# EAGLE design NanoV3.3 (EAGLE 9.6.2)
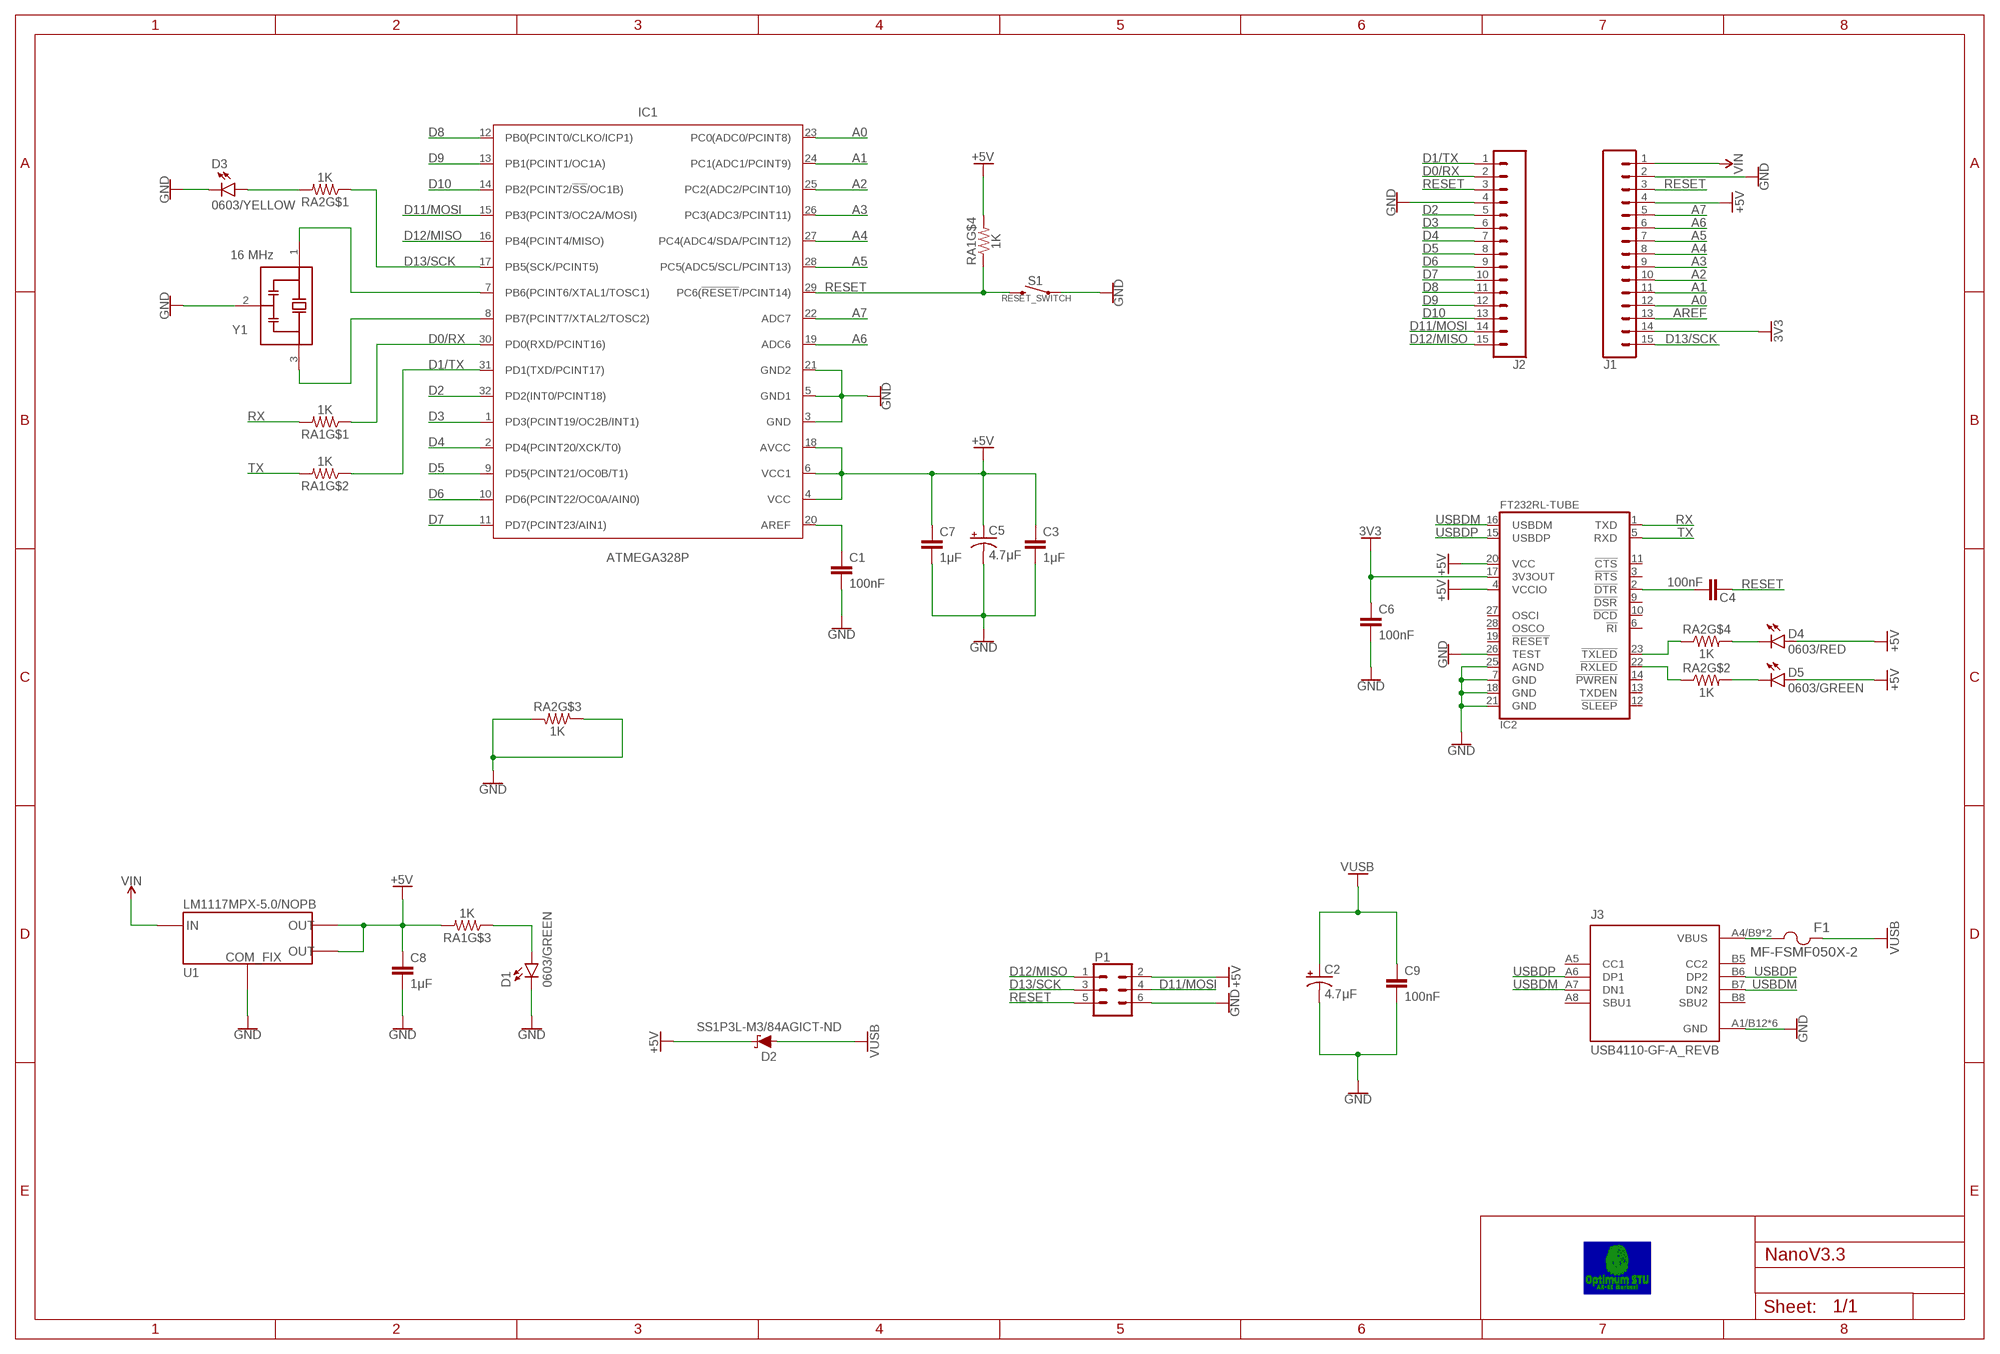
[diagram p0: schematic, sheet 1]

## Parts
C1  100nF  100NF_0603(1608METRIC)_±10%_16V_CERAMIC_CAPACITOR_X7R  [CAP_0603(1608_METRIC)]
C2  4.7μF  4.7UF_TANTALUM_CAPACITOR_MOLDED_1206(3216_METRIC)_TYPE_A_16V_4OHM  [CAP_TANT_1206(3216_METRIC)_TYPE_A_MAX]
C3  1μF  1UF_0603(1608METRIC)_±10%_16V_CERAMIC_CAPACITOR_X7R  [CAP_0603(1608_METRIC)]
C4  100nF  100NF_0603(1608METRIC)_±10%_16V_CERAMIC_CAPACITOR_X7R  [CAP_0603(1608_METRIC)]
C5  4.7μF  4.7UF_TANTALUM_CAPACITOR_MOLDED_1206(3216_METRIC)_TYPE_A_16V_4OHM  [CAP_TANT_1206(3216_METRIC)_TYPE_A_MAX]
C6  100nF  100NF_0603(1608METRIC)_±10%_16V_CERAMIC_CAPACITOR_X7R  [CAP_0603(1608_METRIC)]
C7  1μF  1UF_0603(1608METRIC)_±10%_16V_CERAMIC_CAPACITOR_X7R  [CAP_0603(1608_METRIC)]
C8  1μF  1UF_0603(1608METRIC)_±10%_16V_CERAMIC_CAPACITOR_X7R  [CAP_0603(1608_METRIC)]
C9  100nF  100NF_0603(1608METRIC)_±10%_16V_CERAMIC_CAPACITOR_X7R  [CAP_0603(1608_METRIC)]
D1  0603/GREEN  LED_GREEN_571NM_0603(1608_METRIC)_INDICATION-DISCRETE_2V  [LED_0603(1608_METRIC)_GREEN]
D2  SS1P3L-M3/84AGICT-ND  SS1P3L-M3/84ADIODE_SS1P3L-M3/84A_VIS-M  [DO-220AA(SMP)-M]
D3  0603/YELLOW  LED_YELLOW_591NM_0603(1608_METRIC)_INDICATION-DISCRETE_2.1V  [LED_0603(1608_METRIC)_YELLOW]
D4  0603/RED  LED_RED_631NM_0603(1608_METRIC)_INDICATION-DISCRETE_2V  [LED_0603(1608_METRIC)_RED]
D5  0603/GREEN  LED_GREEN_571NM_0603(1608_METRIC)_INDICATION-DISCRETE_2V  [LED_0603(1608_METRIC)_GREEN]
F1  MF-FSMF050X-2  [PTC_FUSE_0603(1608_METRIC)]
IC1  ATMEGA328P  ATMEGA328P_TQFP  [32-TQFP]
IC2  FT232RL-TUBE  [28-SSOP]
J1  CONN_15_M_180C  [HDRV15W64P254_1X15_3810X254X838B]
J2  CONN_15_M_180C  [HDRV15W64P254_1X15_3810X254X838B]
J3  USB4110-GF-A_REVB  [GCT_USB4110-GF-A_REVB]
P1  CONN_2X3_M_180C  [HDRV6W64P254_2X3_762X508X838B]
RA1  1K  1KOHM_ARRAY_4_ELEMENT_ISOLATED_NETWORK/ARRAY_±5%_62.5MW_FOR_PER_RESISTOR_±200PPM/°C_1206(3216_METRIC),CONVEX,LONG_SIDE_TERMINALS  [RESISTOR_ARRAY_1206(3216_METRIC)_WIDE]
RA2  1K  1KOHM_ARRAY_4_ELEMENT_ISOLATED_NETWORK/ARRAY_±5%_62.5MW_FOR_PER_RESISTOR_±200PPM/°C_1206(3216_METRIC),CONVEX,LONG_SIDE_TERMINALS  [RESISTOR_ARRAY_1206(3216_METRIC)_WIDE]
S1  RESET SWITCH  RS-282C05A3-SM_RT  [SW_TS09-63-25-WT-260-SMT-TR]
U1  LM1117MPX-5.0/NOPB  LM1117MPX-5.0/NOPB_LINEAR_VOLTAGE_REGULATOR_IC_POSITIVE_FIXED_1OUTPUT_800MA_SOT-223-4  [SOT-223-4]
Y1  16 MHz  CSTNE16M0V53L000R0_16MHZ_CERAMIC_RESONATOR_BUILT-IN_CAPACITOR_15PF_±0.2%_40OHMS-40°C~85°C_SURFACE_MOUNT  [RESONATOR_SMD-3(3.20MMX1.30MM)]

## Nets
3V3: C6.1 IC2.17(3V3OUT) J1.14
+5V: C3.1 C5.1(+) C7.1 C8.1 D2.1(C) D4.A D5.A IC1.4(VCC) IC1.6(VCC1) IC1.18(AVCC) IC2.4(VCCIO) IC2.20(VCC) J1.4 P1.2 RA1.5 RA1.6 U1.2(OUTPUT_JUNCTİON) U1.4(OUTPUT_TAB)
A0: IC1.23(PC0(ADC0/PCINT8)) J1.12
A1: IC1.24(PC1(ADC1/PCINT9)) J1.11
A2: IC1.25(PC2(ADC2/PCINT10)) J1.10
A3: IC1.26(PC3(ADC3/PCINT11)) J1.9
A4: IC1.27(PC4(ADC4/SDA/PCINT12)) J1.8
A5: IC1.28(PC5(ADC5/SCL/PCINT13)) J1.7
A6: IC1.19(ADC6) J1.6
A7: IC1.22(ADC7) J1.5
AREF: C1.1 IC1.20(AREF) J1.13
D0/RX: IC1.30(PD0(RXD/PCINT16)) J2.2 RA1.1
D1/TX: IC1.31(PD1(TXD/PCINT17)) J2.1 RA1.2
D2: IC1.32(PD2(INT0/PCINT18)) J2.5
D3: IC1.1(PD3(PCINT19/OC2B/INT1)) J2.6
D4: IC1.2(PD4(PCINT20/XCK/T0)) J2.7
D5: IC1.9(PD5(PCINT21/OC0B/T1)) J2.8
D6: IC1.10(PD6(PCINT22/OC0A/AIN0)) J2.9
D7: IC1.11(PD7(PCINT23/AIN1)) J2.10
D8: IC1.12(PB0(PCINT0/CLKO/ICP1)) J2.11
D9: IC1.13(PB1(PCINT1/OC1A)) J2.12
D10: IC1.14(PB2(PCINT2/!SS!/OC1B)) J2.13
D11/MOSI: IC1.15(PB3(PCINT3/OC2A/MOSI)) J2.14 P1.4
D12/MISO: IC1.16(PB4(PCINT4/MISO)) J2.15 P1.1
D13/SCK: IC1.17(PB5(SCK/PCINT5)) J1.15 P1.3 RA2.1
DTR: C4.2 IC2.2(!DTR)
GND: C1.2 C2.2(-) C3.2 C5.2(-) C6.2 C7.2 C8.2 C9.2 D1.C D3.C IC1.3(GND) IC1.5(GND1) IC1.21(GND2) IC2.7(GND) IC2.18(GND) IC2.21(GND) IC2.25(AGND) IC2.26(TEST) J1.2 J2.4 J3.A1/B12(GND) J3.B1/A12(GND) J3.S1(GND) J3.S2(GND) J3.S3(GND) J3.S4(GND) P1.6 RA2.3 RA2.6 S1.1 U1.1(COMMON_FIXED) Y1.2(GND)
N$1: D3.A RA2.8
N$10: D1.A RA1.3
N$12: F1.1 J3.A4/B9(VBUS) J3.B4/A9(VBUS)
N$13: D4.C RA2.5
N$14: D5.C RA2.7
OSC1: IC1.7(PB6(PCINT6/XTAL1/TOSC1)) Y1.1(IN)
OSC2: IC1.8(PB7(PCINT7/XTAL2/TOSC2)) Y1.3(OUT)
RESET: C4.1 IC1.29(PC6(!RESET!/PCINT14)) J1.3 J2.3 P1.5 RA1.4 S1.2
RX: IC2.1(TXD) RA1.8
RXLED: IC2.22(!RXLED) RA2.2
TX: IC2.5(RXD) RA1.7
TXLED: IC2.23(!TXLED) RA2.4
USBDM: IC2.16(USBDM) J3.A7(DN1) J3.B7(DN2)
USBDP: IC2.15(USBDP) J3.A6(DP1) J3.B6(DP2)
VIN: J1.1 U1.3(INPUT)
VUSB: C2.1(+) C9.1 D2.2(A) F1.2
Unconnected: IC2.3(!RTS) IC2.6(!RI) IC2.9(!DSR) IC2.10(!DCD) IC2.11(!CTS) IC2.12(!SLEEP) IC2.13(TXDEN) IC2.14(!PWREN) IC2.19(!RESET) IC2.27(OSCI) IC2.28(OSCO) J3.A5(CC1) J3.A8(SBU1) J3.B5(CC2) J3.B8(SBU2)

## Notes on the sheet
- RESET_SWITCH

## Library data of the parts
C1 C4 C6 C9 = capacitor:100NF: 100nF Capacitor; WHERE_TO_BUY: https://www.digikey.com/en/products/detail/samsung-electro-mechanics/CL10B104KO8WPNC/5961066?s=N4IgTCBcDaIMIBkCMAGAQqgLAaQPIA4B1ABQDk4QBdAXyA; WHERE_TO_BUY_2: https://ozdisan.com/passive-components/capacitors/smt-smd-and-mlcc-capacitors/CL10B104KO8WPNC; WHERE_TO_BUY_3: https://www.direnc.net/100nf-50v-603-smd-kondansator
C2 C5 = capacitor:4.7UF_TANTALUM: 4.7μF Capacitor; WHERE_TO_BUY: https://www.digikey.com/en/products/detail/kemet/T491A475K016AT/818558; WHERE_TO_BUY_2: https://ozdisan.com/p/939?ids=12069;479927,9697;355990,9736;390966&groupids=12069,9697,9736&propids=479927,355990,390966&inStock=true&sayfaAdedi=20; WHERE_TO_BUY_3: https://www.direnc.net/47uf16v-a-case-tantal
C3 C7 C8 = capacitor:1UF: 1μF Capacitor; WHERE_TO_BUY: https://www.digikey.com/en/products/detail/yageo/CC0603KRX7R7BB105/2833611?s=N4IgTCBcDaIMJwAwDZEGYDSAlAGgdizwCEiBGRAVhAF0BfIA; WHERE_TO_BUY_2: https://ozdisan.com/p/57?ids=9695;452009,9697;356298,9736;355997&groupids=9695,9697,9736&propids=452009,356298,355997&inStock=true&sayfaAdedi=20; WHERE_TO_BUY_3: https://www.direnc.net/1uf-50v-10-603-smd-kondansator
D1 D5 = LED:LED_GREEN: LED Green; WHERE_TO_BUY: https://www.digikey.com/en/products/detail/liteon/LTST-C190KGKT/386815?s=N4IgTCBcDaIDIBUDKCC0BhAjATgAwGkBxfBEAXQF8g; WHERE_TO_BUY_2: https://ozdisan.com/Product/Detail/358986/LTST-C190KGKT; WHERE_TO_BUY_3: https://www.direnc.net/yesil-603-kilif-smd-led-4000-adet-honglitronic
D2 = Schottky_Diode:SS1P3L-M3/84A: Diode Schottky 30 V 1.5A Surface Mount DO-220AA (SMP) General Product Attributes TYPE DESCRIPTION Category Discrete Semiconductor Products Diodes - Rectifiers - Single Package Tape & Reel (TR) Cut Tape (CT) Diode Type Schottky Voltage - DC Reverse (Vr) (Max) 30 V Current - Average Rectified (Io) 1.5A Voltage - Forward (Vf) (Max) @ If 450 mV @ 1 A Speed Fast Recovery =< 500ns, > 200mA (Io) Current - Reverse Leakage @ Vr 200 µA @ 30 V Capacitance @ Vr, F 130pF @ 4V, 1MHz Package / Case DO-220AA Operating Temperature - Junction -55°C ~ 150°C Check availability 1 <https://www.digikey.com/en/products/detail/vishay-general-semiconductor-diodes-division/SS1P3L-M3-84A/1091542> Check availability 2 <https://ozdisan.com/guc-yari-iletkenleri/diyotlar-modul-diyotlar-ve-dogrultucular/schottky-diyotlar/SS1P3L-M384A?gclid=CjwKCAiA68ebBhB-EiwALVC-Njpa8BLgxEpv5seEktyTOdj44lEWUqxNtJiCz2XO_aoOL5DonAWcqBoCpQEQAvD_BwE> Check availability 2 <https://www.direnc.net/ss1p3l-m3/84a-schottky-diyot-smd-15a-30v>; COPYRIGHT: Copyright (C) 2022 Ultra Librarian. All rights reserved.; DIGI-KEY_PART_NUMBER_1: SS1P3L-M3/84AGITR-ND; DIGI-KEY_PART_NUMBER_2: SS1P3L-M3/84AGICT-ND; DIGI-KEY_PART_NUMBER_3: SS1P3L-M3/84AGITR-NDL; MANUFACTURER_PART_NUMBER: SS1P3L-M3/84A; MFR_NAME: Vishay
D3 = LED:LED_YELLOW: LED Yellow; WHERE_TO_BUY: https://www.digikey.com/en/products/detail/liteon/LTST-C190KSKT/386819; WHERE_TO_BUY_2: https://ozdisan.com/Product/Detail/472348/LTST-C190KSKT
D4 = LED:LED_RED: LED Red; WHERE_TO_BUY: https://www.digikey.com/en/products/detail/liteon/LTST-C190KRKT/386817; WHERE_TO_BUY_2: https://ozdisan.com/Product/Detail/456428/LTST-C190KRKT; WHERE_TO_BUY_3: https://www.direnc.net/kirmizi-603-kilif-smd-led-4000-adet-honglitronic-hl-pst-1608s9ac
F1 = Fuses:MF-FSMF050X-2: Polymeric PTC Resettable Fuse 6V 500 mA Ih Surface Mount 0603 (1608 Metric), Concave General Product Attributes TYPE DESCRIPTION Category Circuit Protection PTC Resettable Fuses Package Tape & Reel (TR), Cut Tape (CT), Digi-Reel® Type Polymeric Voltage - Max 6V Current - Max 40 A Current - Hold (Ih) (Max) 500 mA Current - Trip (It) 1A Time to Trip 100 ms Resistance - Initial (Ri) (Min) 100 mOhms Resistance - Post Trip (R1) (Max) 800 mOhms Operating Temperature -40°C ~ 85°C Package / Case 0603 (1608 Metric), Concave Size / Dimension 0.065" L x 0.033" W (1.65mm x 0.85mm) Check availability 1 <https://www.digikey.com/en/products/detail/bourns-inc/MF-FSMF050X-2/2039256?s=N4IgTCBcDaILIDEEGVEAYCsaAEIC6AvkA> Check availability 2 <https://ozdisan.com/circuit-protections/fuse-components/ptc-resettable-fuses/MF-FSMF050X-2>; COPYRIGHT: Copyright (C) 2022 Ultra Librarian. All rights reserved.; DIGI-KEY_PART_NUMBER_1: MF-FSMF050X-2TR-ND; DIGI-KEY_PART_NUMBER_2: MF-FSMF050X-2CT-ND; DIGI-KEY_PART_NUMBER_3: MF-FSMF050X-2DKR-ND; MANUFACTURER_PART_NUMBER: MF-FSMF050X-2; MFR_NAME: Bourns Electronics
IC1 = MCUs:ATMEGA328P: AVR Automotive, AEC-Q100, AVR® ATmega Microcontroller IC 8-Bit 16MHz 32KB (16K x 16) FLASH 32-TQFP (7x7) General Product Attributes TYPE DESCRIPTION Category Integrated Circuits (ICs) Embedded Microcontrollers Package Tape & Reel (TR), Cut Tape (CT), Digi-Reel® Core Processor AVR Core Size 8-Bit Speed 16MHz Connectivity I²C, SPI, UART/USART Peripherals Brown-out Detect/Reset, POR, PWM, WDT Number of I/O 23 Program Memory Size 32KB (16K x 16) Program Memory Type FLASH EEPROM Size 1K x 8 RAM Size 2K x 8 Voltage - Supply (Vcc/Vdd) 2.7V ~ 5.5V Data Converters A/D 8x10b Oscillator Type Internal Operating Temperature -40°C ~ 125°C (TA) Package / Case 32-TQFP Check availability 1 <https://www.digikey.com/en/products/detail/microchip-technology/ATMEGA328P-15AZ/1914586> Check availability 2 <https://ozdisan.com/entegre-devreler-ics/embedded-entegreler/mikroislemciler/ATMEGA328P-AU> Check availability 3 <https://www.direnc.net/atmega328p-au-smd-8bit-20mhz-mikrodenetleyici-tqfp32>; CATEGORY: IC_Embedded; MANUFACTURER: Microchip; MPN: ATmega328P-MMH; OPERATING_TEMP: -40 to 85 °C; PART_STATUS: Active; SUB-CATEGORY: Microcontroller
IC2 = Interface_IC:FT232RL-TUBE: USB Bridge, USB to UART USB 2.0 UART Interface 28-SSOP General Product Attributes TYPE DESCRIPTION Category Integrated Circuits (ICs) Interface Controllers Package Tape & Reel (TR), Cut Tape (CT), Digi-Reel® Voltage - Supply 3.3V ~ 5.25V Current - Supply 15mA Protocol USB Function Bridge, USB to UART Interface UART Standards USB 2.0 and above Package / Case 28-SSOP (0.209", 5.30mm Width) Operating Temperature -40°C ~ 85°C Check availability 1 <https://www.digikey.com/en/products/detail/ftdi-future-technology-devices-international-ltd/FT232RL-REEL/1836385> Check availability 2 <https://www.ozdisan.com/entegre-devreler-ics/interface-entegreleri/arayuz-kontrolor-entegreleri/FT232RL-REEL?gclid=Cj0KCQiAyMKbBhD1ARIsANs7rEH5nL4zGQNjIm9H6IfOHmbKrHZhGkLXqnmHJcjBe75xEtirwoN-tjMaAottEALw_wcB> Check availability 3 <https://www.direnc.net/ft232rl-smd-usb-arayuz-entegresi-ssop28?gclid=Cj0KCQiAyMKbBhD1ARIsANs7rEGRq_nWoeRoGa1PW6j5uqWsWLvdYBQpScLCh9l1b6xB9LhU1UKlLSEaAhxYEALw_wcB>; DESCRIPTION: USB Bridge, USB to UART USB 2.0 UART Interface 28-SSOP; DIGI-KEY_PART_NUMBER: 768-1306-ND; MF: FTDI,; MP: FT232RL-TUBE; PACKAGE: SSOP-28 FTDI; PURCHASE-URL: https://pricing.snapeda.com/search/part/FT232RL-TUBE/?ref=eda
J1 J2 = connectors:CONN_15: Generic Connector Header Through Hole 15 position 0.100" (2.54mm) General Product Attributes TYPE DESCRIPTION Category Connectors, Interconnects Rectangular Connectors - Headers Package Bulk Connector Type Header, Breakaway Pitch - Mating 0.100" (2.54mm) Number of Positions 15 Number of Rows 1 Style Board to Board or Cable Shrouding Unshrouded Mounting Type Through Hole Termination Solder Insulation Material Polybutylene Terephthalate (PBT) Operating Temperature -40°C ~ 105°C Insulation Color Black Current Rating (Amps) 3A per Contact; GENDER: MALE; MANUFACTURER_PRODUCT_NUMBER: PREC015SAAN-RC; PITCH: 2.54; POSITION: 15; ROW: 1
J3 = USB Connectors:USB4110-GF-A_REVB: USB-C (USB TYPE-C) USB 2.0 Receptacle Connector 24 (16+8 Dummy) Position Surface Mount, Right Angle General Product Attributes TYPE DESCRIPTION Category Connectors, Interconnects USB, DVI, HDMI Connectors USB, DVI, HDMI Connector Assemblies Package Tape & Reel (TR) Cut Tape (CT) Digi-Reel® Connector Type USB-C (USB TYPE-C) Number of Contacts 24 (16+8 Dummy) Gender Receptacle Specifications USB 2.0 Mounting Type Surface Mount, Right Angle Mounting Feature Horizontal Termination Solder Features Board Guide, Solder Retention Current Rating (Amps) 0.25A, 1.25A, 5A, 6.25A Operating Temperature -40°C ~ 85°C Voltage - Rated 20VDC Mating Cycles 10000 Shielding Shielded Contact Finish Gold Shell/Shielding Material Steel, Stainless Material Flammability Rating UL94 V-0 Check availability 1 <https://www.digikey.com/en/products/detail/gct/USB4110-GF-A/10384547?s=N4IgTCBcDaIKoGUBCAWAjGgDAWgOIDFsBBEAXQF8g> Check availability 2 <https://ozdisan.com/connectors-and-interconnects/usb-dvi-hdmi-connectors/usb-connectors/USB4110-GF-A>; AVAILABILITY: In Stock; DESCRIPTION: USB-C (USB TYPE-C) USB 2.0 Receptacle Connector 24 (16+8 Dummy) Position Surface Mount, Right Angle; Through Hole; MF: GCT; MP: USB4110-GF-A; PACKAGE: None; PRICE: None; PURCHASE-URL: https://pricing.snapeda.com/search/part/USB4110-GF-A/?ref=eda
P1 = connectors:CONN_2X3: Generic Connector Header Through Hole 2 row 6 position 2 0.100" (2.54mm) General Product Attributes TYPE DESCRIPTION Category Connectors, Interconnects Rectangular Connectors - Headers Package Bulk Connector Type Header, Breakaway Pitch - Mating 0.100" (2.54mm) Number of Positions 6 Number of Rows 2 Style Board to Board or Cable Shrouding Unshrouded Mounting Type Through Hole Termination Solder Insulation Material Polybutylene Terephthalate (PBT) Operating Temperature -40°C ~ 105°C Insulation Color Black Current Rating (Amps) 3A per Contact; GENDER: MALE; MANUFACTURER_PRODUCT_NUMBER: PREC020DAAN-RC; PITCH-POSITION: 2.54; PITCH-ROW: 2.54; POSITION: 6; ROW: 2
RA1 RA2 = resistors_smd:1KOHM_ARRAY_4: 1KΩ Element Isolated 4 Resistor Network/Array; DESCRIPTION: 1k Ohm ±5% 62.5mW Power Per Element Isolated 4 Resistor Network/Array ±200ppm/°C 1206 (3216 Metric), Convex, Long Side Terminals; MANUFACTURER_PRODUCT_NUMBER: CAY16-102J4LF; WHERE_TO_BUY: https://www.digikey.com/en/products/detail/bourns-inc/CAY16-102J4LF/2566676; WHERE_TO_BUY_2: https://www.e-komponent.com/1k-ohm-power-per-element-isolated-4-resistor-network-array-convex-long-side-terminals
S1 = Switches:RS-282C05A3-SM_RT: Tactile Switch SPST-NO Top Actuated Surface Mount General Product Attributes TYPE DESCRIPTION Mounting Type SMT V/T Outline (mm) 6.00mm x 3.60mm Actuator Height off PCB, From Pins 2.50mm Operating Force 260gF Termination Style Gull Wing Actuator Orientation Top Actuated Check availability 1 <https://www.digikey.com/en/products/detail/c-k/RS-282G05A3-SM-RT/2747190>
U1 = Converters-regulators:LM1117MPX-5.0/NOPB: Linear Voltage Regulator IC Positive Fixed 1 Output 800mA SOT-223-4 General Product Attributes TYPE DESCRIPTION Category Integrated Circuits (ICs) Power Management (PMIC) Voltage Regulators - Linear Package Tape & Reel (TR) Cut Tape (CT) Digi-Reel® Output Configuration Positive Output Type Fixed Voltage - Input (Max) 15V Voltage - Output (Min/Fixed) 5V Voltage Dropout (Max) 1.2V @ 800mA Current - Output 800mA Current - Quiescent (Iq) 5 mA Current - Supply (Max) 10 mA PSRR 75dB (120Hz) Protection Features Over Current, Over Temperature Operating Temperature 0°C ~ 125°C Package / Case TO-261-4, TO-261AA Supplier Device Package SOT-223-4 Check availability 1 <https://www.digikey.com/en/products/detail/texas-instruments/LM1117MPX-5-0-NOPB/366734> Check availability 2 <https://www.ozdisan.com/entegre-devreler-ics/guc-entegreleri/ic-lineer-voltaj-regulatorleri/LM1117MPX-5-0NOPB> Check availability 2 <https://www.direnc.net/lm1117-5v-smd-ldo-voltage-regulators-800ma-ldo-linear-reg>
Y1 = Resonator:CSTNE16M0V53L000R0: 16 MHz Ceramic Resonator Built in Capacitor 15 pF ±0.2% 40 Ohms -40°C ~ 85°C Surface Mount General Product Attributes TYPE DESCRIPTION Category Crystals, Oscillators, Resonators Resonators Package Tape & Reel (TR), Cut Tape (CT), Digi-Reel® Type Ceramic Frequency 16 MHz Frequency Stability ±0.2% Frequency Tolerance ±0.5% Features Built in Capacitor Capacitance 15 pF Impedance 40 Ohms Operating Temperature -40°C ~ 85°C Package / Case 3-SMD, Non-Standard Size / Dimension 0.126" L x 0.051" W (3.20mm x 1.30mm) Height 0.039" (1.00mm) Check availability 1 <https://www.digikey.com/en/products/detail/murata-electronics/CSTNE16M0V53L000R0/12173987> Check availability 2 <https://ozdisan.com/passive-components/crystals-oscillators-and-resonators/resonators/CSTNE16M0V530000R0>; DESCRIPTION: 16 MHz Ceramic Resonator Built in Capacitor 15 pF ±0.2% 40 Ohms -40°C ~ 85°C Surface Mount; DIGI-KEY_PART_NUMBER: 490-CSTNE16M0V53L000R0TR-ND; MF: Murata Electronics; MP: CSTNE16M0V53L000R0; PACKAGE: SMD-3 Murata; PURCHASE-URL: https://pricing.snapeda.com/search/part/CSTNE16M0V53L000R0/?ref=eda

## Board
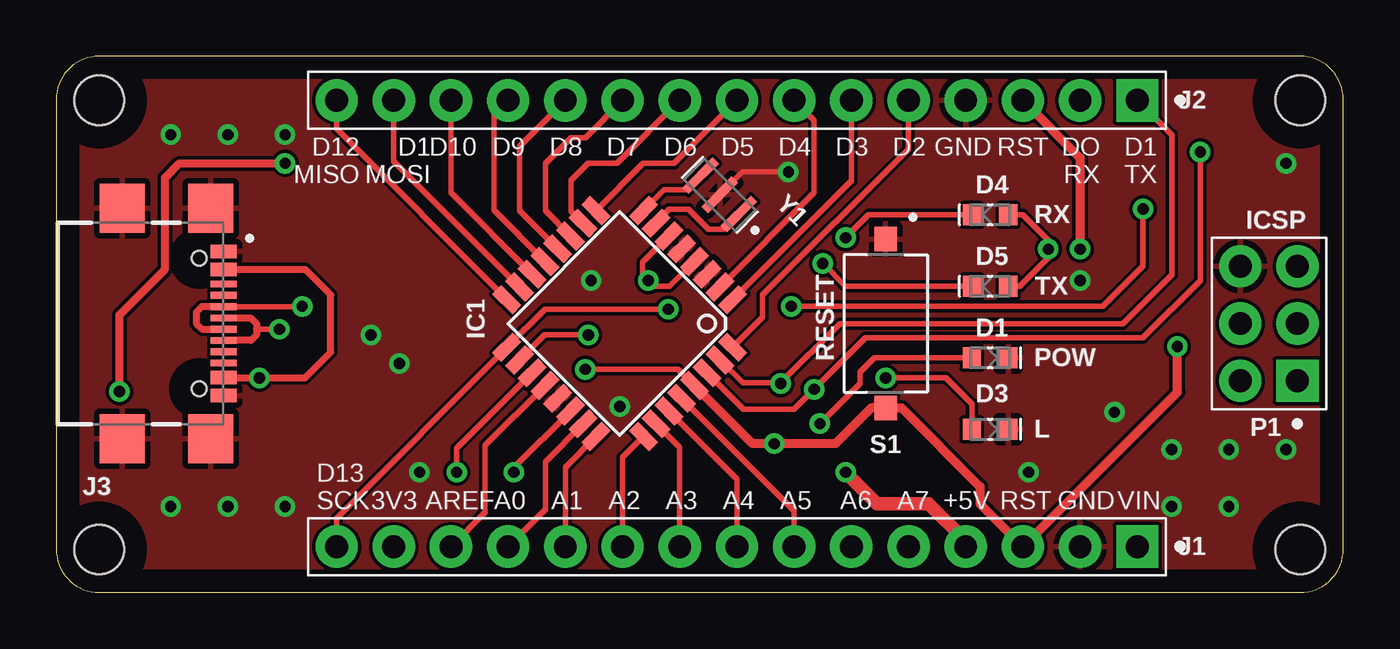
[diagram p1: board, top side]
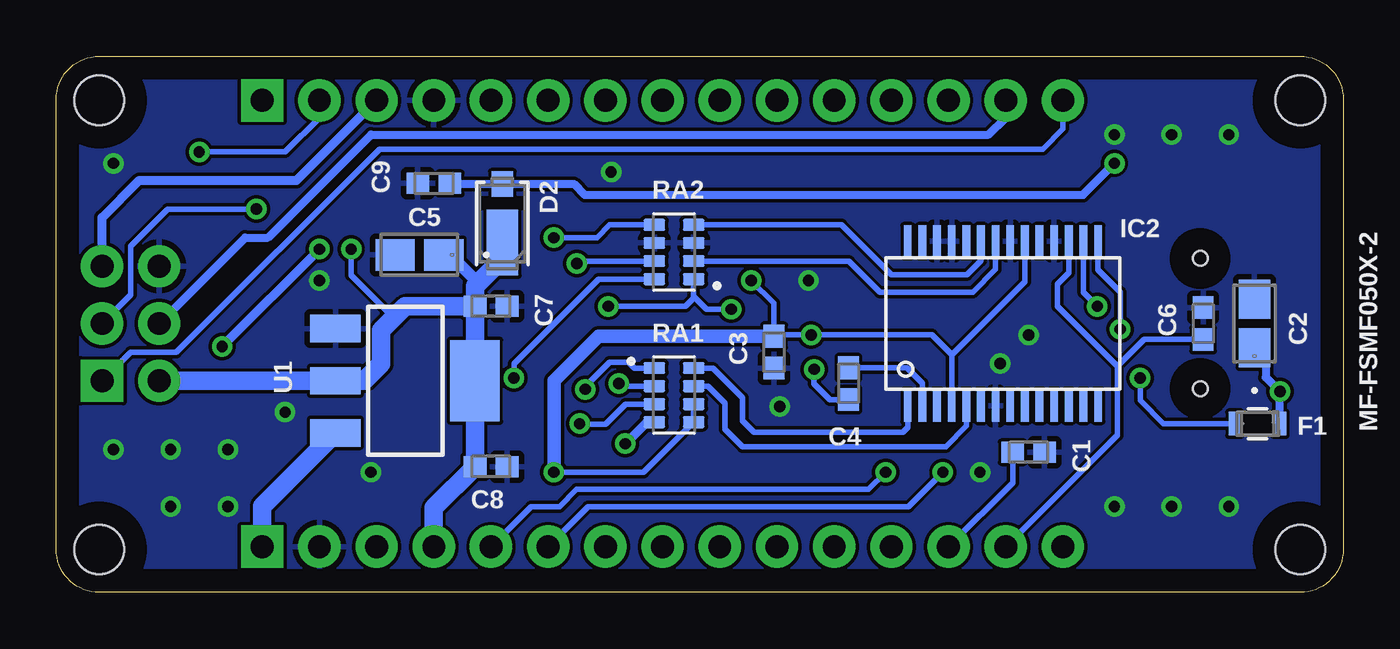
[diagram p2: board, bottom side, seen from below]

Size 57.15 x 23.8 mm. Coordinates in mm from the lower left corner, seen from the top.
Outline: 0,21.89 0,1.91 arc90 1.91,0 55.24,0 arc90 57.15,1.91 57.15,21.89 arc90 55.24,23.8 1.91,23.8 arc90 0,21.89
Copper layers (1*16): Top 0.035mm / dielectric 1.5mm / Bottom 0.035mm
Design rules "default": minimum track width 6mil, minimum drill 0.35mm, track to track 6mil, track to pad 6mil, pad to pad 6mil, via to via 6mil, smd to smd 6mil, copper to edge 40mil, drill to drill 6mil, minimum pad ring 10mil, minimum via ring 8mil, stop-mask expansion 4mil, vias tented up to drill 0mil, thermal gap 10mil
Holes 2.2 mm at 1.91,1.91 1.91,21.84 55.24,21.84 55.24,1.91

### Footprints (pad centres in the part's own frame; a part is rotated, then mirrored left to right if it is on the bottom)
CAP_0603(1608_METRIC) = smd 1.01 x 0.93: 1 -0.709,0; 2 0.709,0
CAP_TANT_1206(3216_METRIC)_TYPE_A_MAX = smd 1.741 x 1.397: 1 -1.082,0; 2 1.082,0
LED_0603(1608_METRIC)_GREEN = smd 0.81 x 0.93: A 0.81,0; C -0.81,0
DO-220AA(SMP)-M = smd 2.916 x 1.396: 1 -0.849,0 | smd 1.113 x 0.964: 2 1.75,0
LED_0603(1608_METRIC)_YELLOW = smd 0.81 x 0.93: A 0.81,0; C -0.81,0
LED_0603(1608_METRIC)_RED = smd 0.81 x 0.93: A 0.81,0; C -0.81,0
PTC_FUSE_0603(1608_METRIC) = smd 0.553 x 1.041: 1 -1,0; 2 1,0
32-TQFP = smd 1.27 x 0.559: 1 -4.293,2.8; 2 -4.293,2; 3 -4.293,1.2; 4 -4.293,0.4; 5 -4.293,-0.4; 6 -4.293,-1.2; 7 -4.293,-2; 8 -4.293,-2.8; 17 4.293,-2.8; 18 4.293,-2; 19 4.293,-1.2; 20 4.293,-0.4; 21 4.293,0.4; 22 4.293,1.2; 23 4.293,2; 24 4.293,2.8 | smd 0.559 x 1.27: 9 -2.8,-4.293; 10 -2,-4.293; 11 -1.2,-4.293; 12 -0.4,-4.293; 13 0.4,-4.293; 14 1.2,-4.293; 15 2,-4.293; 16 2.8,-4.293; 25 2.8,4.293; 26 2,4.293; 27 1.2,4.293; 28 0.4,4.293; 29 -0.4,4.293; 30 -1.2,4.293; 31 -2,4.293; 32 -2.8,4.293
28-SSOP = smd 0.348 x 1.397: 1 -4.225,-3.656; 2 -3.575,-3.656; 3 -2.925,-3.656; 4 -2.275,-3.656; 5 -1.625,-3.656; 6 -0.975,-3.656; 7 -0.325,-3.656; 8 0.325,-3.656; 9 0.975,-3.656; 10 1.625,-3.656; 11 2.275,-3.656; 12 2.925,-3.656; 13 3.575,-3.656; 14 4.225,-3.656; 15 4.225,3.656; 16 3.575,3.656; 17 2.925,3.656; 18 2.275,3.656; 19 1.625,3.656; 20 0.975,3.656; 21 0.325,3.656; 22 -0.325,3.656; 23 -0.975,3.656; 24 -1.625,3.656; 25 -2.275,3.656; 26 -2.925,3.656; 27 -3.575,3.656; 28 -4.225,3.656
HDRV15W64P254_1X15_3810X254X838B = drill 1.016 pad 1.88 square: 1 0,0 | drill 1.016 pad 1.88: 2 2.54,0; 3 5.08,0; 4 7.62,0; 5 10.16,0; 6 12.7,0; 7 15.24,0; 8 17.78,0; 9 20.32,0; 10 22.86,0; 11 25.4,0; 12 27.94,0; 13 30.48,0; 14 33.02,0; 15 35.56,0
GCT_USB4110-GF-A_REVB = smd 0.6 x 1.15: A1/B12 -3.2,1.075; A4/B9 -2.4,1.075; B1/A12 3.2,1.075; B4/A9 2.4,1.075 | smd 0.3 x 1.15: A5 -1.25,1.075; A6 -0.25,1.075; A7 0.25,1.075; A8 1.25,1.075; B5 1.75,1.075; B6 0.75,1.075; B7 -0.75,1.075; B8 -1.75,1.075 | smd 2.18 x 2: S1 -5.11,0.5; S2 5.11,0.5; S3 -5.11,-3.43; S4 5.11,-3.43 | hole 0.65: -2.89,0; 2.89,0
HDRV6W64P254_2X3_762X508X838B = drill 1.016 pad 1.88 square: 1 0,0 | drill 1.016 pad 1.88: 2 0,2.54; 3 2.54,0; 4 2.54,2.54; 5 5.08,0; 6 5.08,2.54
RESISTOR_ARRAY_1206(3216_METRIC)_WIDE = smd 0.97 x 0.53: 1 -0.875,1.2; 2 -0.875,0.4; 3 -0.875,-0.4; 4 -0.875,-1.2; 5 0.875,-1.2; 6 0.875,-0.4; 7 0.875,0.4; 8 0.875,1.2
SW_TS09-63-25-WT-260-SMT-TR = smd 1.1 x 1: 1 -3.75,0; 2 3.75,0
SOT-223-4 = smd 1.219 x 2.235: 1 -2.311,-3.099; 2 0,-3.099; 3 2.311,-3.099 | smd 3.6 x 2.2: 4 0,3.099
RESONATOR_SMD-3(3.20MMX1.30MM) = smd 0.4 x 1.9: 1 -1.2,0; 2 0,0; 3 1.2,0

### Placement (x,y rotation side)
C1  13.97,6.22 0 bottom
C2  3.94,11.94 90 bottom
C3  25.27,10.67 270 bottom
C4  21.97,9.27 90 bottom
C5  41.02,14.99 180 bottom
C6  6.22,11.94 90 bottom
C7  37.85,12.7 0 bottom
C8  37.85,5.59 0 bottom
C9  40.39,18.16 180 bottom
D1  41.47,10.41 180 top
D2  37.34,16.38 90 bottom
D3  41.47,7.24 180 top
D4  41.47,16.76 0 top
D5  41.47,13.59 0 top
F1  3.81,7.49 0 bottom
IC1  25.02,11.94 225 top
IC2  15.11,11.94 0 bottom
J1  48.01,2.03 180 top
J2  48.01,21.84 180 top
J3  6.35,11.94 270 top
P1  55.12,9.4 90 top
RA1  29.72,8.76 0 bottom
RA2  29.72,15.11 180 bottom
S1  36.83,11.94 270 top
U1  41.66,9.4 270 bottom
Y1  29.46,17.65 135 top

### Tracks (layer width: path | path; a pad name or v marks a point on that pad's centre or on a via)
3V3
  Bottom 0.254: IC2.17 12.19,14.2 12.7,13.69 12.7,12.7 10.03,10.03 | J1.14 10.03,6.99 10.03,10.03 | 10.03,10.03 8.84,11.23 C6.1
+5V  (via drill 0.5 pad 0.91)
  Top 0.254: D5.A 42.78,13.59 44.05,14.86 v44.05,15.24 44.05,15.64 42.93,16.76 D4.A | IC1.6 26.04,14.65 26.04,14.1 v26.29,13.84 26.54,13.59 27.24,13.59 IC1.4 | IC1.18 21.68,11.43 v23.62,11.43
  Top 0.61: J1.4 40.39,2.29 38.73,3.94 36.45,3.94 v35.05,5.33
  Bottom 0.254: RA1.6 RA1.5 31.07,5.33 v35.05,5.33 | IC2.20 14.14,13.8 17.39,10.55 | 17.39,10.55 IC2.4 | 17.39,10.55 18.27,11.43 v23.62,11.43 25.22,11.43 C3.1 25.27,12.83 v26.29,13.84 | v44.05,15.24 44.05,14.08 42.16,12.19
  Bottom 0.508: 38.55,13.6 38.55,13.89 39.65,14.99 C5.1
  Bottom 0.61: v35.05,5.33 35.05,9.4 33.07,11.38 C3.1
  Bottom 0.813: J1.4 40.39,3.76 C8.1 U1.4 C7.1 | C7.1 41.66,12.7 42.16,12.19 42.72,11.63 42.72,10.16 43.48,9.4 U1.2 P1.2 | C7.1 38.55,13.6 37.34,14.81 D2.1
A0
  Top 0.254: J1.12 21.72,3.68 21.72,5.81 IC1.23
A1
  Top 0.254: J1.11 22.61,5.57 IC1.24
A2
  Top 0.254: IC1.25 25.15,5.99 J1.10
A3
  Top 0.254: IC1.26 27.69,6.44 J1.9
A4
  Top 0.254: IC1.27 30.23,5.03 J1.8
A5
  Top 0.254: IC1.28 32.77,3.62 J1.7
A6  (via drill 0.5 pad 0.91)
  Top 0.254: v17.78,5.33 17.78,6.4 IC1.19
  Bottom 0.254: J1.6 33.53,3.81 19.3,3.81 v17.78,5.33
A7  (via drill 0.5 pad 0.91)
  Top 0.254: IC1.22 20.32,5.54 v20.32,5.34
  Bottom 0.254: J1.5 36.07,3.81 34.8,3.81 34.04,4.57 21.08,4.57 v20.32,5.34
AREF
  Top 0.254: J1.13 19.05,3.56 19.05,6.54 IC1.20
  Bottom 0.254: J1.13 14.68,4.88 C1.1
D0/RX  (via drill 0.5 pad 0.91)
  Top 0.254: v50.8,19.56 50.8,13.84 48.26,11.3 35.94,11.3 v33.66,9.02 32.77,8.13 30.53,8.13 IC1.30
  Bottom 0.254: J2.2 45.47,21.08 46.99,19.56 v50.8,19.56 | RA1.1 31.48,9.96 31.74,10.22 32.58,10.22 33.66,9.14 v33.66,9.02
D1/TX  (via drill 0.5 pad 0.91)
  Top 0.254: IC1.31 30.48,9.3 32.14,9.3 v32.16,9.27 32.16,9.3 34.8,11.94 47.37,11.94 49.53,14.1 49.53,20.32 J2.1
  Bottom 0.254: RA1.2 32.06,9.16 v32.16,9.27
D2
  Top 0.254: J2.5 37.85,19.68 31.37,13.21 31.37,12.22 IC1.32
D3
  Top 0.254: IC1.1 35.31,18.27 J2.6
D4
  Top 0.254: IC1.2 33.66,17.75 33.66,20.95 J2.7
D5
  Top 0.254: IC1.9 26.06,19.05 27.43,19.05 J2.8
D6
  Top 0.254: IC1.10 22.86,16.93 22.86,18.29 23.62,19.05 24.89,19.05 J2.9
D7
  Top 0.254: IC1.11 21.72,16.94 21.72,19.05 22.86,20.19 23.5,20.19 J2.10
D8
  Top 0.254: IC1.12 20.57,16.95 20.57,19.81 J2.11
D9
  Top 0.254: IC1.13 19.43,16.96 19.43,21.21 J2.12
D10
  Top 0.254: IC1.14 17.53,17.73 J2.13
D11/MOSI
  Top 0.254: IC1.15 14.99,19.14 J2.14
  Bottom 0.356: P1.4 48.77,15.75 47.75,15.75 43.18,20.32 15.75,20.32 14.99,21.08 J2.14
D12/MISO
  Top 0.254: IC1.16 20,13.02 12.45,20.57 J2.15
  Bottom 0.254: P1.1 53.85,10.67 51.82,10.67 42.8,19.68 13.34,19.68 12.45,20.57 J2.15
D13/SCK  (via drill 0.5 pad 0.91)
  Top 0.254: J1.15 12.45,3.3 20,10.86 IC1.17 21.69,12.57 v27.18,12.57 | v48.26,17.02 48.26,14.48 46.48,12.7 v32.64,12.7
  Bottom 0.254: v27.18,12.57 28.27,12.57 28.84,13.15 RA2.1 28.84,13.1 28.83,13.08 29.21,12.7 v32.64,12.7 | P1.3 53.85,13.21 53.85,15.37 52.2,17.02 v48.26,17.02
DTR
  Bottom 0.254: IC2.2 18.69,9.29 19.38,9.98 C4.2
GND  (via drill 0.5 pad 0.91)
  Top 0.254: v32.51,18.67 30.48,18.67 Y1.2
  other vias: 10.16,20.32 10.16,3.81 13.97,11.43 23.75,13.84 43.18,5.33 7.62,20.32 5.08,20.32 5.08,3.81 7.62,3.81 54.61,19.05 49.53,3.81 52.07,3.81 25.02,8.26 16.13,5.33 46.99,8 45.47,13.84 15.24,10.16 54.61,6.35 52.07,6.35 49.53,6.35
  pour Bottom (isolate 0.005): 1.91,23.75 55.24,23.75 arc-90 57.15,21.84 57.15,1.91 arc-90 55.24,0 1.91,0 arc-90 0,1.91 0,21.84 arc-90
  pour Top (isolate 0.005): 0,21.84 0,1.91 arc90 1.91,0 55.24,0 arc90 57.15,1.91 57.15,21.84 arc90 55.24,23.75 1.91,23.75 arc90
N$1  (via drill 0.5 pad 0.91)
  Top 0.254: D3.A 40.66,8.37 39.5,9.53 v36.83,9.53
  Bottom 0.254: v36.83,9.53 36.83,10.16 33.08,13.91 RA2.8
N$10  (via drill 0.5 pad 0.91)
  Top 0.254: D1.A 36.32,10.41 35.69,9.78 35.69,9.27 v33.91,7.49
  Bottom 0.254: v33.91,7.49 33.91,7.47 32.75,7.47 31.86,8.36 RA1.3
N$12  (via drill 0.5 pad 0.91)
  Top 0.305: J3.B4/A9 v9.03,9.54 v9.02,9.53 11.05,9.53 12.19,10.67 12.19,13.21 11.06,14.34 J3.A4/B9
  Bottom 0.254: F1.1 7.99,7.49 9.02,8.52 v9.02,9.53
N$13  (via drill 0.5 pad 0.91)
  Top 0.254: D4.C 36.07,16.76 v35.05,15.75
  Bottom 0.254: v35.05,15.75 33.15,15.75 32.58,16.31 RA2.5
N$14  (via drill 0.5 pad 0.91)
  Top 0.254: D5.C 35.05,13.59 v34.04,14.61
  Bottom 0.254: RA2.7 33.93,14.71 v34.04,14.61
OSC1
  Top 0.254: IC1.7 26.64,16.43 27.21,17 28.08,17 28.96,16.13 29.64,16.13 Y1.1
OSC2
  Top 0.254: IC1.8 26.99,17.87 27.98,17.87 Y1.3
RESET  (via drill 0.5 pad 0.91)
  Top 0.254: IC1.29 27.62,9.91 v23.5,9.91
  Top 0.406: IC1.29 30.92,6.6 v31.88,6.6 34.61,6.6 36.2,8.19 S1.2 37.53,8.19 41.02,4.7 41.02,3.94 J1.3 49.78,8.89 v49.78,10.92 | J2.3 45.47,19.3 v45.47,15.24
  Bottom 0.254: C4.1 22.79,8.56 23.5,9.27 v23.5,9.91
  Bottom 0.406: P1.5 55.12,16.64 53.47,18.29 46.48,18.29 J2.3 | RA1.4 30.92,7.56 v31.88,6.6 | v49.78,10.92 v45.47,15.24
RX
  Bottom 0.254: IC2.1 19.34,7.33 19.56,7.11 26.16,7.11 26.67,7.62 26.67,8.64 28,9.96 RA1.8
RXLED
  Bottom 0.254: RA2.2 21.95,14.71 20.57,13.34 16.44,13.34 15.44,14.34 IC2.22
TX
  Bottom 0.254: IC2.5 16.74,7.39 17.65,6.48 26.67,6.48 27.45,7.25 27.45,8.4 28.21,9.16 RA1.7
TXLED
  Bottom 0.254: RA2.4 22.28,16.31 20.07,14.1 16.71,14.1 16.09,14.72 IC2.23
USBDM  (via drill 0.5 pad 0.91)
  Top 0.254: J3.B7 10.91,12.69 v10.92,12.7
  Top 0.305: J3.B7 6.46,12.69 6.22,12.45 6.22,11.94 6.47,11.69 J3.A7
  Bottom 0.254: IC2.16 11.54,13.32 v10.92,12.7
USBDP  (via drill 0.5 pad 0.91)
  Top 0.254: v9.91,11.68 8.89,11.68
  Top 0.305: J3.A6 8.64,12.19 8.89,11.94 8.89,11.68 8.89,11.43 8.65,11.19 J3.B6
  Bottom 0.254: IC2.15 10.89,14.32 9.91,13.34 v9.91,11.68
VIN
  Bottom 0.813: U1.3 48.01,3.83 J1.1
VUSB  (via drill 0.5 pad 0.91)
  Top 0.356: v2.81,8.91 2.81,12.34 4.83,14.35 4.83,18.41 5.46,19.05 v10.16,19.05
  Bottom 0.356: C2.1 3.44,10.36 3.44,9.55 v2.81,8.91 F1.2 | v10.16,19.05 11.56,17.65 33.68,17.65 34.16,18.13 D2.2 39.65,18.13 C9.1

### Text on the board
tPlace: D12 / MISO | D1 / MOSI | D10 | D9 | D8 | D7 | D6 | D5 | D4 | D3 | D2 | GND | RST | DO / RX | D1 / TX | RX | ICSP | TX | RESET | POW | L | D13 / SCK | 3V3 | AREF | A0 | A1 | A2 | A3 | A4 | A5 | A6 | A7 | +5V | RST | GND | VIN
bNames: D2 | C5 | C2 | F1